# Altium project Hardware.PrjPCB
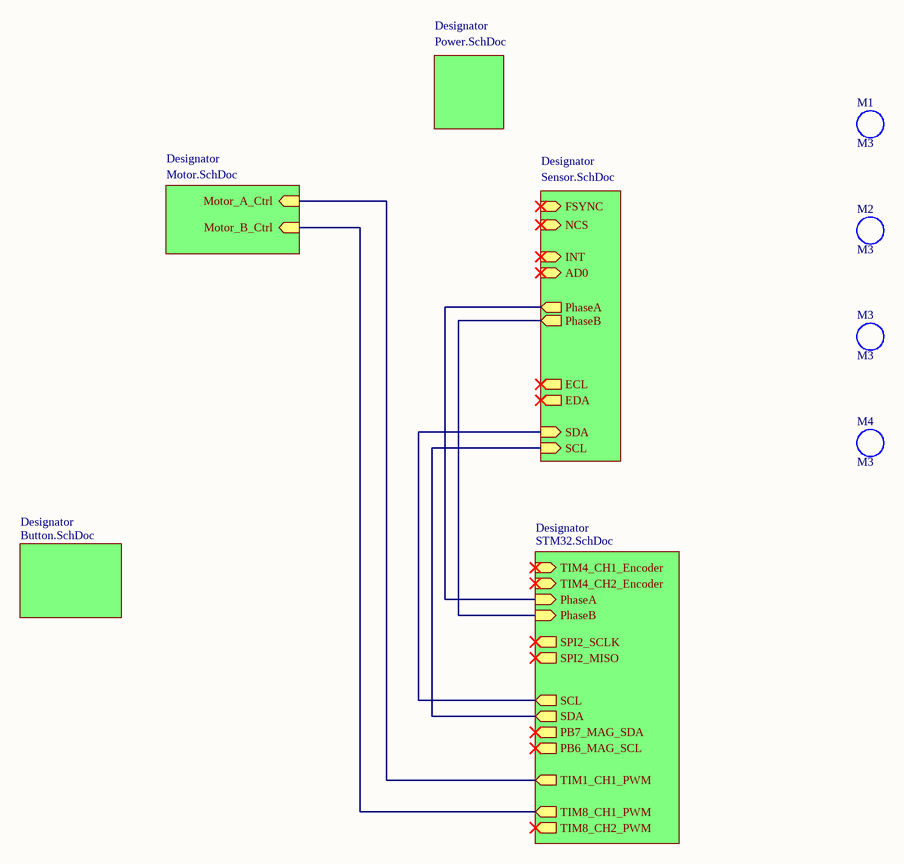
[diagram p0: General.SchDoc]
6 sheets, 28 parts. Net scope: hierarchical (ports join the sheet entries above them; power ports are global).
Board file: Hardware.PcbDoc
Sheets:
  General.SchDoc
    Designator = Motor.SchDoc
    Designator = Power.SchDoc
    Designator = Sensor.SchDoc
    Designator = STM32.SchDoc
    Designator = Button.SchDoc

## Sheet General.SchDoc
size A3

### Parts
M1  M3  [M3 140X350]
M2  M3  [M3 140X350]
M3  M3  [M3 140X350]
M4  M3  [M3 140X350]

### Sub-sheets
Designator = Motor.SchDoc: Motor_A_Ctrl (in), Motor_B_Ctrl (in)
Designator = Power.SchDoc: no entries
Designator = Sensor.SchDoc: FSYNC (in), NCS (in), INT (in), AD0 (in), ECL (out), EDA (out), SDA (in), SCL (in), PhaseB (out), PhaseA (out)
Designator = STM32.SchDoc: SPI2_SCLK (out), TIM1_CH1_PWM (out), PB6_MAG_SCL (out), PB7_MAG_SDA (out), SPI2_MISO (out), TIM4_CH1_Encoder (in), TIM8_CH1_PWM (out), TIM4_CH2_Encoder (in), TIM8_CH2_PWM (out), PhaseA (in), PhaseB (in), SCL (out), SDA (out)
Designator = Button.SchDoc: no entries

### Nets
NetJP2_1: sheet Designator/Motor_A_Ctrl, sheet Designator/TIM1_CH1_PWM
NetJP2_2: sheet Designator/Motor_B_Ctrl, sheet Designator/TIM8_CH1_PWM
NetJP6_2: sheet Designator/PhaseA, sheet Designator/PhaseA
NetJP6_3: sheet Designator/PhaseB, sheet Designator/PhaseB
NetJP7_3: sheet Designator/SCL, sheet Designator/SDA
NetJP7_4: sheet Designator/SDA, sheet Designator/SCL

### Library data of the parts
M1-M4 = M3: 铜柱孔; 版权归属: 源创客; BOM名称: 铜柱孔; 学习资源: www.ooocke.com

## Sheet Motor.SchDoc
size A3
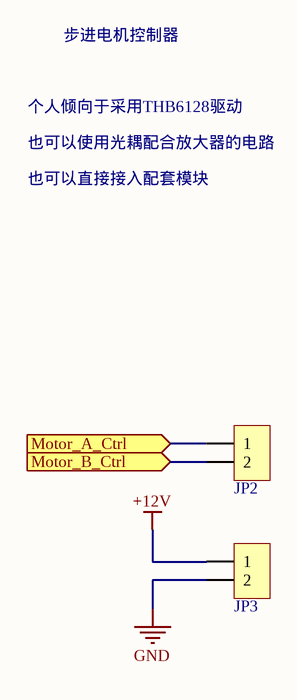
[diagram p1: Motor.SchDoc]

### Parts
JP2  HDR-1X2  [KF350-2P]  (value not drawn)
JP3  HDR-1X2  [KF128-3.81-2P]  (value not drawn)

### Ports
Motor_A_Ctrl (in), Motor_B_Ctrl (in)

### Nets
+12V: JP3.1
GND: JP3.2
NetJP2_1: JP2.1 ; port Motor_A_Ctrl
NetJP2_2: JP2.2 ; port Motor_B_Ctrl

### Notes on the sheet
- 步进电机控制器
- 个人倾向于采用THB6128驱动
- 也可以使用光耦配合放大器的电路
- 也可以直接接入配套模块

### Library data of the parts
JP2 JP3 = Header 2: 2P接插件; 版权归属: 源创客; BOM名称: 2P接插件; 学习资源: www.ooocke.com

## Sheet Power.SchDoc
size A3
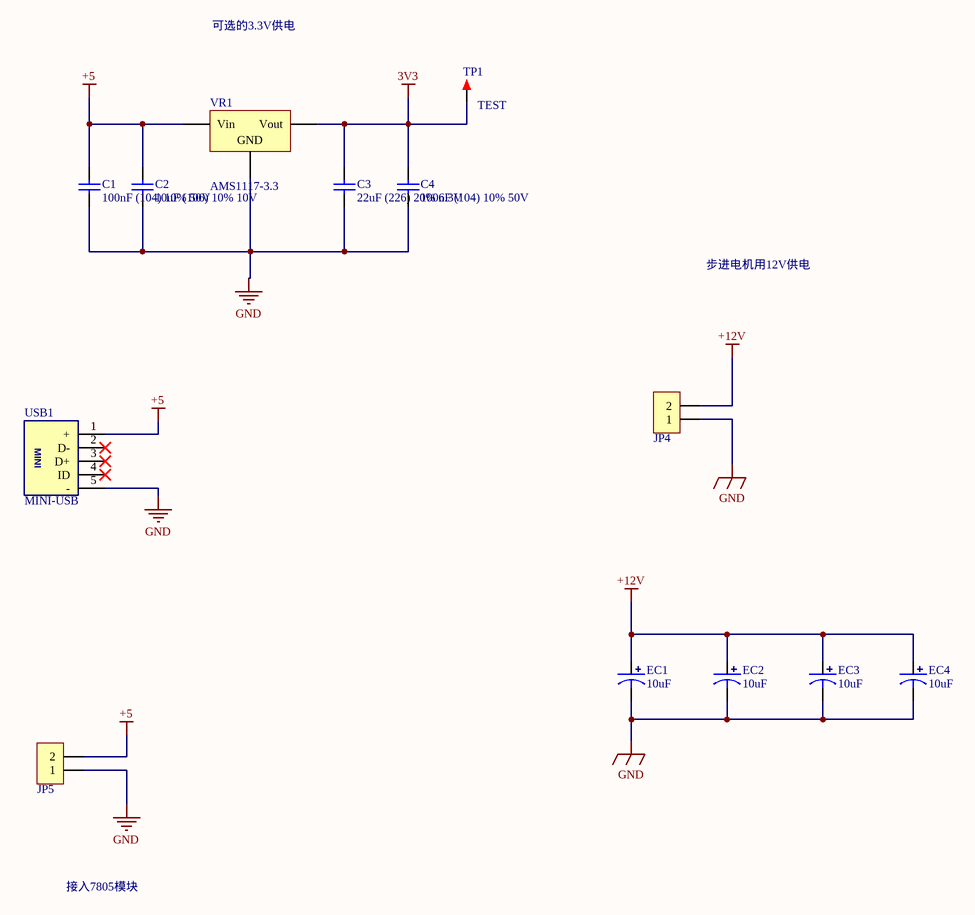
[diagram p2: Power.SchDoc]

### Parts
C1  100nF (104) 10% 50V  [0603_C]
C2  10uF (106) 10% 10V  [0603_C]
C3  22uF (226) 20% 6.3V  [0603_C]
C4  100nF (104) 10% 50V  [0603_C]
EC1  10uF  [DIP-EC1.5X4X8]
EC2  10uF  [DIP-EC1.5X4X8]
EC3  10uF  [DIP-EC1.5X4X8]
EC4  10uF  [DIP-EC1.5X4X8]
JP4  HDR-1X2  [KF7620-2P]  (value not drawn)
JP5  HDR-1X2  [KF7620-2P]  (value not drawn)
TP1  TEST  [TEST 1]
USB1  MINI-USB  [USB-MINI-A]
VR1  AMS1117-3.3  [SOT-223]

### Nets
3V3: C3.2 C4.2 TP1.1 VR1.2(Vout)
+5: C1.2 C2.2 JP5.2 USB1.1(+) VR1.3(Vin)
+12V: EC1.1 EC2.1 EC3.1 EC4.1 JP4.2
GND: C1.1 C2.1 C3.1 C4.1 EC1.2 EC2.2 EC3.2 EC4.2 JP4.1 JP5.1 USB1.5(-) VR1.1(GND)

Not connected (* = marked no-connect by the designer): USB1 2(D-)* 3(D+)* 4(ID)*

### Notes on the sheet
- 可选的3.3V供电
- 步进电机用12V供电
- 接入7805模块
- (in symbol MINI-USB) MINI

### Library data of the parts
C1 C4 = 0603 100nF (104) 10% 50V: 贴片电容; ComponentLink1Description: 供应商链接; ComponentLink1URL: http://www.szlcsc.com/product/details_15331.html; Package: 0603; Supplier: LC; SuppliersPartNumber: C14663
C2 = 0603 10uF (106) 10% 10V: 贴片电容; ComponentLink1Description: 供应商链接; ComponentLink1URL: http://www.szlcsc.com/product/details_20411.html; Package: 0603; Supplier: LC; SuppliersPartNumber: C19702
C3 = 0603 22uF (226) 20% 6.3V: 贴片电容; ComponentLink1Description: 供应商链接; ComponentLink1URL: http://www.szlcsc.com/product/details_60514.html; Package: 0603; Supplier: LC; SuppliersPartNumber: C59461
EC1-EC4 = DIP_ECAP: 直插电解电容
JP4 JP5 = Header 2: 2P接插件; 版权归属: 源创客; BOM名称: 2P接插件; 学习资源: www.ooocke.com
TP1 = TEST: 测试点; 版权归属: 源创客; BOM名称: 测试点; 学习资源: www.ooocke.com
VR1 = SOT-223 AMS1117-3.3: 低压差线性稳压(LDO); ComponentLink1Description: 供应商链接; ComponentLink1URL: http://www.szlcsc.com/product/details_6652.html; Package: SOT-223; Supplier: LC; SuppliersPartNumber: C6186

## Sheet Sensor.SchDoc
size A3
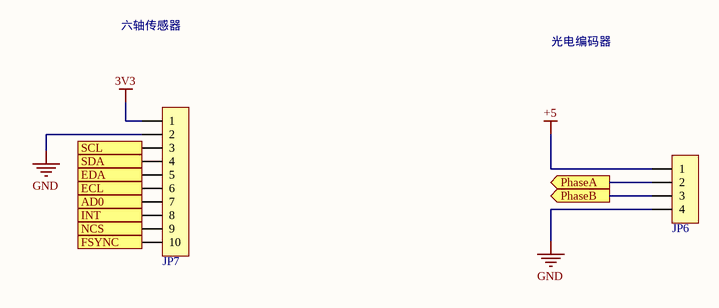
[diagram p3: Sensor.SchDoc]

### Parts
JP6  HDR-1X4  [KF350-4P]  (value not drawn)
JP7  HDR-1X10  [HDR2.54-LI-10P]  (value not drawn)

### Ports
AD0 (in), ECL (out), EDA (out), FSYNC (in), INT (in), NCS (in), PhaseA (out), PhaseB (out), SCL (in), SDA (in)

### Nets
3V3: JP7.1
+5: JP6.1
GND: JP6.4 JP7.2
NetJP6_2: JP6.2 ; port PhaseA
NetJP6_3: JP6.3 ; port PhaseB
NetJP7_3: JP7.3 ; port SCL
NetJP7_4: JP7.4 ; port SDA
NetJP7_5: JP7.5 ; port EDA
NetJP7_6: JP7.6 ; port ECL
NetJP7_7: JP7.7 ; port AD0
NetJP7_8: JP7.8 ; port INT
NetJP7_9: JP7.9 ; port NCS
NetJP7_10: JP7.10 ; port FSYNC

### Notes on the sheet
- 六轴传感器
- 光电编码器

### Library data of the parts
JP6 = Header 4: 4P接插件; 版权归属: 源创客; BOM名称: 4P接插件; 学习资源: www.ooocke.com
JP7 = Header 10: 10P接插件; 版权归属: 源创客; BOM名称: 10P接插件; 学习资源: www.ooocke.com

## Sheet STM32.SchDoc
size A3
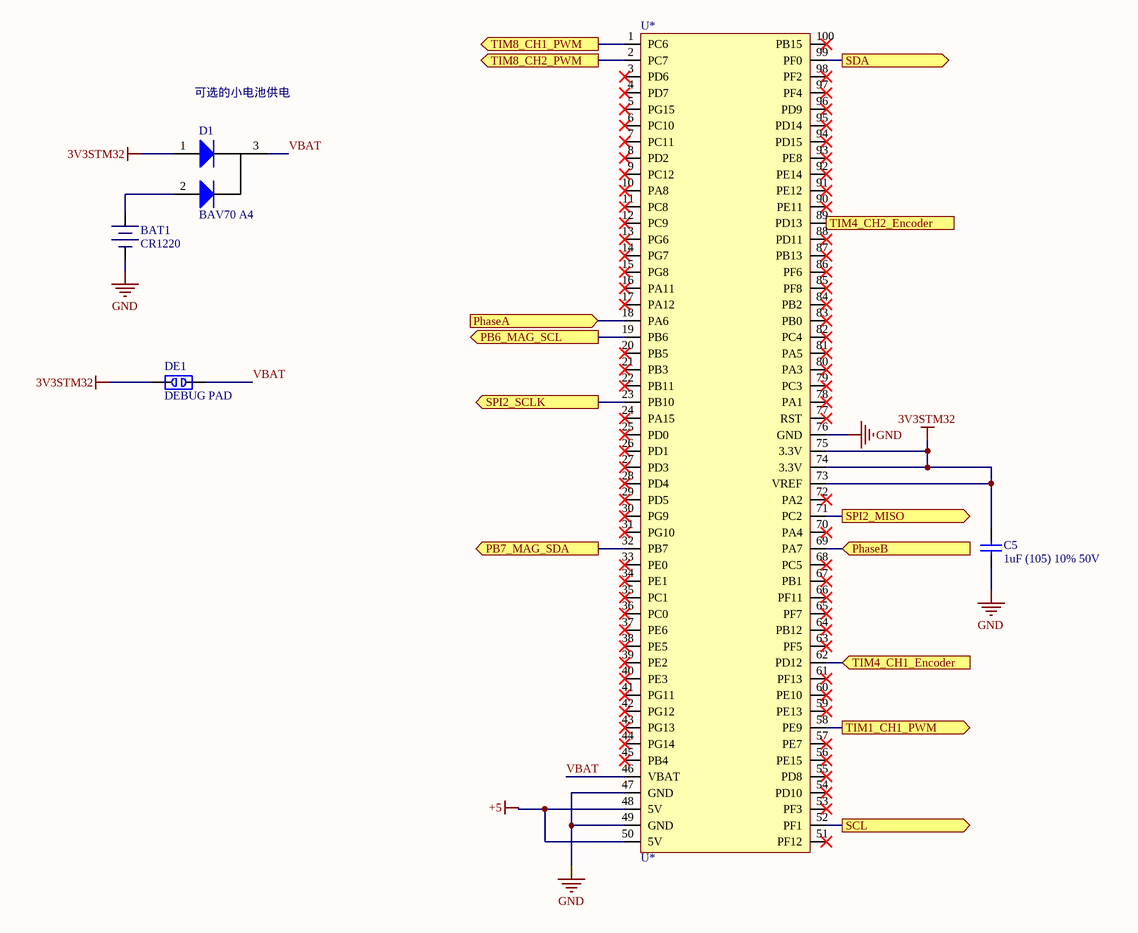
[diagram p4: STM32.SchDoc]

### Parts
BAT1  CR1220  [CR1220-A]
C5  1uF (105) 10% 50V  [0603_C]
D1  BAV70 A4  [SOT-23(SOT-23-3)]
DE1  DEBUG PAD  [DEBUG_B]
U*  U*  [STM32F407MiniBoard]

### Ports
PB6_MAG_SCL (out), PB7_MAG_SDA (out), PhaseA (in), PhaseB (in), SCL (out), SDA (out), SPI2_MISO (out), SPI2_SCLK (out), TIM1_CH1_PWM (out), TIM4_CH1_Encoder (in), TIM4_CH2_Encoder (in), TIM8_CH1_PWM (out), TIM8_CH2_PWM (out)

### Nets
3V3STM32: C5.2 D1.1(A) DE1.1 U*.73(VREF) U*.74(3.3V) U*.75(3.3V)
+5: U*.48(5V) U*.50(5V)
GND: BAT1.2 C5.1 U*.47(GND) U*.49(GND) U*.76(GND)
VBAT: D1.3(K) DE1.2 U*.46(VBAT)
NetBAT1_1: BAT1.1 D1.2(A)
NetJP2_1: U*.58(PE9) ; port TIM1_CH1_PWM
NetJP2_2: U*.1(PC6) ; port TIM8_CH1_PWM
NetJP6_2: U*.18(PA6) ; port PhaseA
NetJP6_3: U*.69(PA7) ; port PhaseB
NetJP7_3: U*.99(PF0) ; port SDA
NetJP7_4: U*.52(PF1) ; port SCL
NetU*_2: U*.2(PC7) ; port TIM8_CH2_PWM
NetU*_19: U*.19(PB6) ; port PB6_MAG_SCL
NetU*_23: U*.23(PB10) ; port SPI2_SCLK
NetU*_32: U*.32(PB7) ; port PB7_MAG_SDA
NetU*_62: U*.62(PD12) ; port TIM4_CH1_Encoder
NetU*_71: U*.71(PC2) ; port SPI2_MISO
NetU*_89: U*.89(PD13) ; port TIM4_CH2_Encoder

Not connected (* = marked no-connect by the designer): U* 3(PD6)* 4(PD7)* 5(PG15)* 6(PC10)* 7(PC11)* 8(PD2)* 9(PC12)* 10(PA8)* 11(PC8)* 12(PC9)* 13(PG6)* 14(PG7)* 15(PG8)* 16(PA11)* 17(PA12)* 20(PB5)* 21(PB3)* 22(PB11)* 24(PA15)* 25(PD0)* 26(PD1)* 27(PD3)* 28(PD4)* 29(PD5)* 30(PG9)* 31(PG10)* 33(PE0)* 34(PE1)* 35(PC1)* 36(PC0)* 37(PE6)* 38(PE5)* 39(PE2)* 40(PE3)* 41(PG11)* 42(PG12)* 43(PG13)* 44(PG14)* 45(PB4)* 51(PF12)* 53(PF3)* 54(PD10)* 55(PD8)* 56(PE15)* 57(PE7)* 59(PE13)* 60(PE10)* 61(PF13)* 63(PF5)* 64(PB12)* 65(PF7)* 66(PF11)* 67(PB1)* 68(PC5)* 70(PA4)* 72(PA2)* 77(RST)* 78(PA1)* 79(PC3)* 80(PA3)* 81(PA5)* 82(PC4)* 83(PB0)* 84(PB2)* 85(PF8)* 86(PF6)* 87(PB13)* 88(PD11)* 90(PE11)* 91(PE12)* 92(PE14)* 93(PE8)* 94(PD15)* 95(PD14)* 96(PD9)* 97(PF4)* 98(PF2)* 100(PB15)*

### Notes on the sheet
- (near D1) 可选的小电池供电

### Library data of the parts
C5 = 0603 1uF (105) 10% 50V: 贴片电容; ComponentLink1Description: 供应商链接; ComponentLink1URL: http://www.szlcsc.com/product/details_16531.html; Package: 0603; Supplier: LC; SuppliersPartNumber: C15849
D1 = SOT-23 BAV70 A4: 开关二极管; ComponentLink1Description: 供应商链接; ComponentLink1URL: http://www.szlcsc.com/product/details_70091.html; Package: SOT-23; Supplier: LC; SuppliersPartNumber: C68978
DE1 = DEBUG: 调试断点焊盘; 版权归属: 源创客; BOM名称: 调试断点焊盘; 学习资源: www.ooocke.com
U* = STM32F407MiniBoard

## Sheet Button.SchDoc
size A3
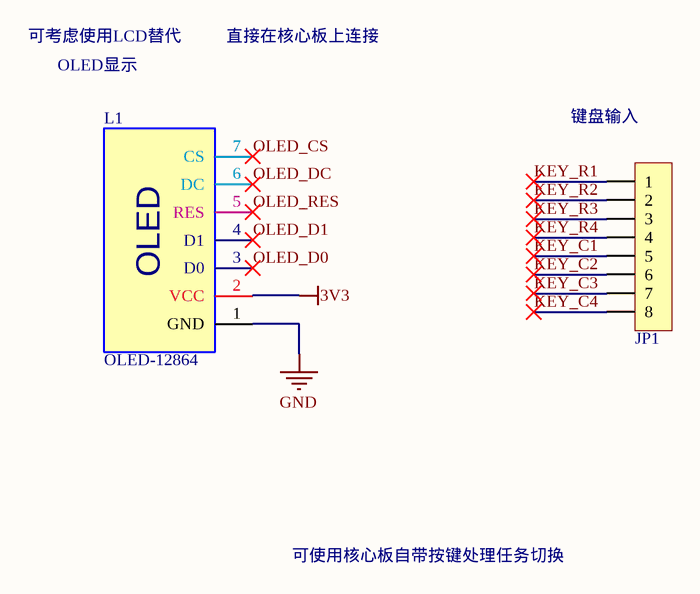
[diagram p5: Button.SchDoc]

### Parts
JP1  HDR-1X8  [HDR2.54-M-LI-8P]  (value not drawn)
L1  OLED-12864  [OLED-12864]

### Nets
3V3: L1.2(VCC)
GND: L1.1(GND)
KEY_C1: JP1.5
KEY_C2: JP1.6
KEY_C3: JP1.7
KEY_C4: JP1.8
KEY_R1: JP1.1
KEY_R2: JP1.2
KEY_R3: JP1.3
KEY_R4: JP1.4
OLED_CS: L1.7(CS)
OLED_D0: L1.3(D0)
OLED_D1: L1.4(D1)
OLED_DC: L1.6(DC)
OLED_RES: L1.5(RES)

### Notes on the sheet
- 可考虑使用LCD替代
- OLED显示
- 直接在核心板上连接
- (near JP1) 键盘输入
- 可使用核心板自带按键处理任务切换
- (in symbol OLED-12864) OLED

### Library data of the parts
JP1 = Header 8: 8P接插件; 版权归属: 源创客; BOM名称: 8P接插件; 学习资源: www.ooocke.com

## Nets that join several sheets
3V3: Power (C3.2 C4.2 TP1.1 VR1.2), Sensor (JP7.1), Button (L1.2)
+5: Power (5 pins), Sensor (JP6.1), STM32 (U*.48 U*.50)
+12V: Motor (JP3.1), Power (5 pins)
GND: Motor (JP3.2), Power (12 pins), Sensor (JP6.4 JP7.2), STM32 (5 pins), Button (L1.1)
NetJP2_1: Motor (JP2.1), STM32 (U*.58)
NetJP2_2: Motor (JP2.2), STM32 (U*.1)
NetJP6_2: Sensor (JP6.2), STM32 (U*.18)
NetJP6_3: Sensor (JP6.3), STM32 (U*.69)
NetJP7_3: Sensor (JP7.3), STM32 (U*.99)
NetJP7_4: Sensor (JP7.4), STM32 (U*.52)